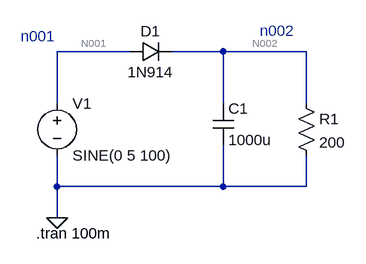
[diagram p0: schematic Yoneda-p85__Rectification-circuit_with-C.asc]
Yoneda-p85__Rectification-circuit_with-C.asc, the LTspice schematic file:
Version 4
SHEET 1 880 680
WIRE 48 -64 -64 -64
WIRE 192 -64 112 -64
WIRE 320 -64 192 -64
WIRE -64 16 -64 -64
WIRE 192 16 192 -64
WIRE 320 16 320 -64
WIRE -64 144 -64 96
WIRE 192 144 192 80
WIRE 192 144 -64 144
WIRE 320 144 320 96
WIRE 320 144 192 144
WIRE -64 192 -64 144
FLAG -64 192 0
SYMBOL diode 48 -80 M90
WINDOW 0 0 32 VBottom 2
WINDOW 3 32 32 VTop 2
SYMATTR InstName D1
SYMATTR Value 1N914
SYMBOL res 304 0 R0
SYMATTR InstName R1
SYMATTR Value 200
SYMBOL voltage -64 0 R0
WINDOW 123 0 0 Left 2
WINDOW 39 0 0 Left 2
SYMATTR InstName V1
SYMATTR Value SINE(0 5 100)
SYMBOL cap 176 16 R0
SYMATTR InstName C1
SYMATTR Value 1000u
TEXT -96 216 Left 2 !.tran 100m
TEXT -120 -88 Left 2 ;n001
TEXT 248 -96 Left 2 ;n002

The netlist it stands for:
* Yoneda-p85__Rectification-circuit_with-C.asc
D1 N001 N002 1N914
R1 N002 0 200
V1 N001 0 SINE(0 5 100)
C1 N002 0 1000u
.model D D
.lib standard.dio
.tran 100m
* n001
* n002
.backanno
.end

* Results of the author's LTspice run, read from the files saved beside the schematic
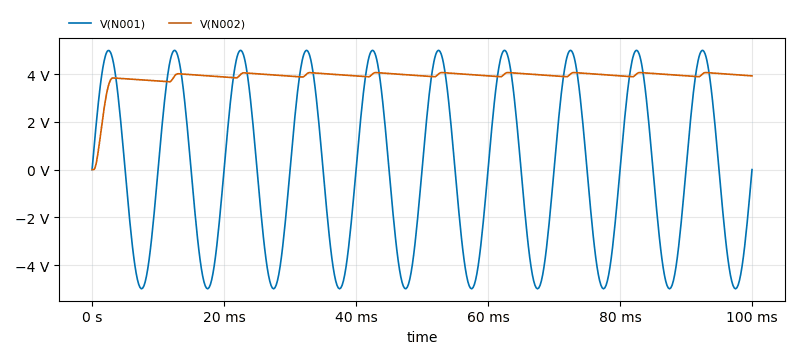
[diagram p1: Transient Analysis of Yoneda-p85__Rectification-circuit_with-C.asc, plotted from the saved traces]
* Transient Analysis, 1 run:
*   V(N001): min -4.995 V, max 4.995 V, average 1.391 mV, rms 3.534 V, last 0 V
*   V(N002): min 0 V, max 4.066 V, average 3.89 V, rms 3.914 V, last 3.926 V